# EAGLE design harp behavior encoder v1.0 (EAGLE 6.5.0)
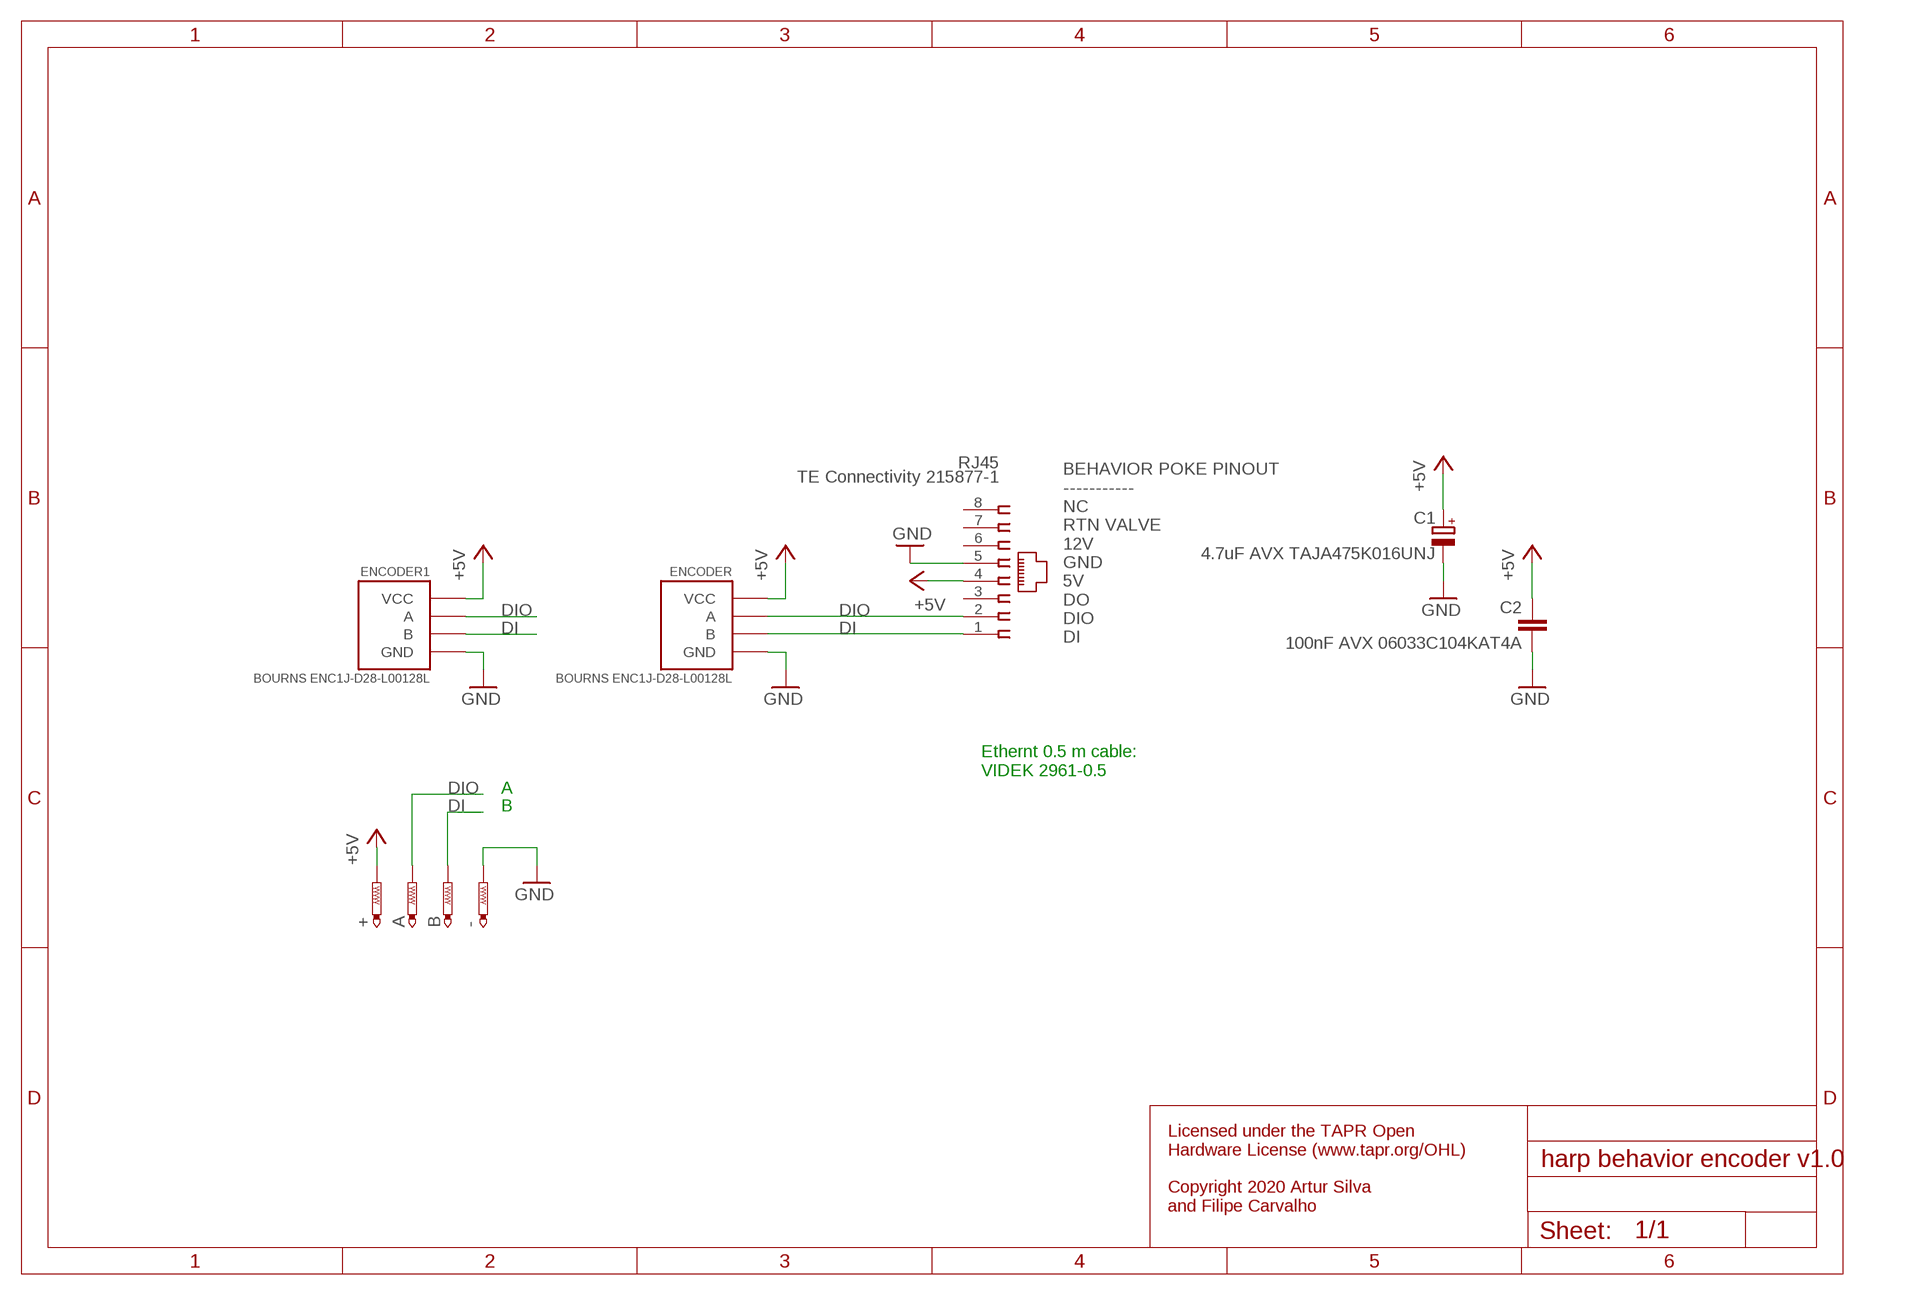
[diagram p0: schematic, sheet 1]

## Parts
+  PTR1PAD1-13  [P1-13]
-  PTR1PAD1-13  [P1-13]
A  PTR1PAD1-13  [P1-13]
B  PTR1PAD1-13  [P1-13]
C1  4.7uF AVX TAJA475K016UNJ  CPOL-EUA/3216-18W  [A/3216-18W]
C2  100nF AVX 06033C104KAT4A  C-EUC0603  [C0603]
ENCODER  BOURNS ENC1J-D28-L00128L  BOURNS_EN  [STYLEC]
ENCODER1  BOURNS ENC1J-D28-L00128L  BOURNS_EN  [STYLEC]
RJ45  TE Connectivity 215877-1  520426-4  [520426-4]

## Nets
+5V: +.TP C1.+ C2.1 ENCODER1.+(VCC) ENCODER.+(VCC) RJ45.4
DI: B.TP ENCODER1.B ENCODER.B RJ45.1
DIO: A.TP ENCODER1.A ENCODER.A RJ45.2
GND: -.TP C1.- C2.2 ENCODER1.-(GND) ENCODER.-(GND) RJ45.5
Unconnected: RJ45.3 RJ45.6 RJ45.7 RJ45.8

## Notes on the sheet
- BEHAVIOR POKE PINOUT
  -----------
  NC
  RTN VALVE
  12V
  GND
  5V
  DO
  DIO
  DI
- Ethernt 0.5 m cable:
  VIDEK 2961-0.5
- A
- B
- Licensed under the TAPR Open 
  Hardware License (www.tapr.org/OHL)
  
  Copyright 2020 Artur Silva 
  and Filipe Carvalho

## Library data of the parts
+ - A B = testpad:PTR1: TEST PIN
C1 = rcl:CPOL-EU: POLARIZED CAPACITOR, European symbol
C2 = rcl:C-EU: CAPACITOR, European symbol
ENCODER ENCODER1 = encoder:BOURNS_EN
RJ45 = con-amp:520426-4: AMP connector

## Board
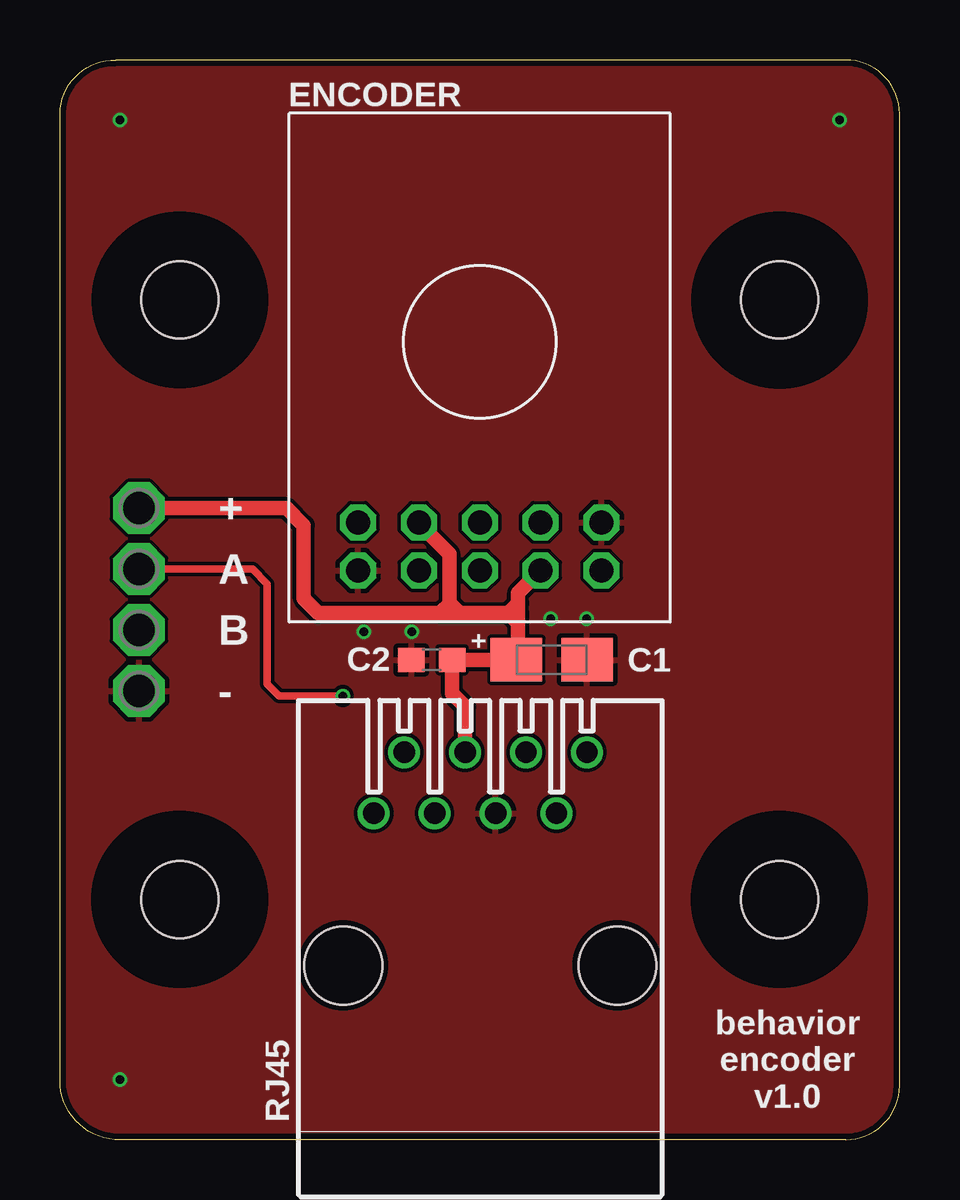
[diagram p1: board, top side]
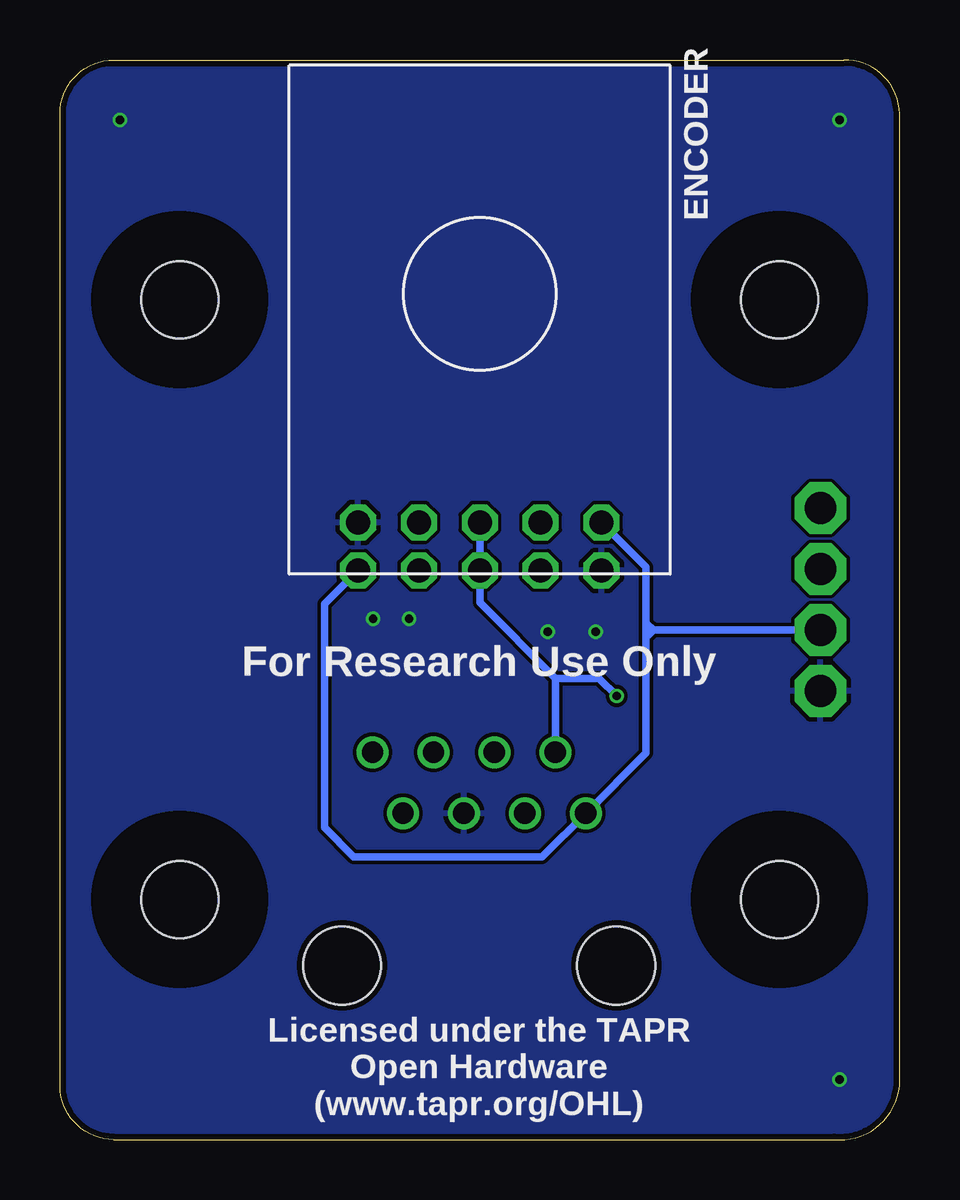
[diagram p2: board, bottom side, seen from below]

Size 35 x 45.01 mm. Coordinates in mm from the lower left corner, seen from the top.
Outline: 32.76,0.01 2.74,0.01 arc-90 0,2.25 0,42.78 arc-90 2.33,45.01 32.76,45.01 arc-90 35,42.78 35,2.25 arc-90 32.76,0.01
Copper layers (1*16): Top 0.018mm / dielectric 1.55mm / Bottom 0.018mm
Design rules "eC_2Layer_PClass6_BaseCopperO18_eCDefault *": minimum track width 0.15mm, minimum drill 0.3mm, track to track 0.15mm, track to pad 0.15mm, pad to pad 0.15mm, via to via 0.15mm, smd to smd 0mil, copper to edge 0.25mm, drill to drill 0.35mm, minimum pad ring 0.175mm, minimum via ring 0.125mm, stop-mask expansion 0mil, vias tented up to drill 0.45mm, thermal gap 0.2mm
Holes 3.2 mm at 5,10.01 30,10.01 5,35.01 30,35.01
tRestrict: area 1.3,31.3 to 8.7,38.7; area 26.3,31.3 to 33.7,38.7; area 1.3,6.3 to 8.7,13.7; area 26.3,6.3 to 33.7,13.7
bRestrict: area 1.3,31.3 to 8.7,38.7; area 26.3,31.3 to 33.7,38.7; area 1.3,6.3 to 8.7,13.7; area 26.3,6.3 to 33.7,13.7

### Footprints (pad centres in the part's own frame; a part is rotated, then mirrored left to right if it is on the bottom)
P1-13 = drill 1.321 pad 2.159 octagon: TP 0,0
A/3216-18W = smd 2.15 x 1.8: + 1.475,0; - -1.475,0
C0603 = smd 1.1 x 1: 1 -0.85,0; 2 0.85,0
STYLEC = drill 1 octagon: + -2.54,9.525; - 5.08,9.525; A 0,9.525; B -5.08,9.525; NC 2.54,9.525
520426-4 = drill 0.889: 1 -4.445,6.35; 2 -3.175,8.89; 3 -1.905,6.35; 4 -0.635,8.89; 5 0.635,6.35; 6 1.905,8.89; 7 3.175,6.35; 8 4.445,8.89 | hole 3.251: -5.715,0; 5.715,0

### Placement (x,y rotation side)
+  3.29,26.33 0 top
-  3.29,18.71 0 top
A  3.29,23.79 0 top
B  3.29,21.25 0 top
C1  20.5,20.01 180 top
C2  15.5,20.01 180 top
ENCODER  17.5,33.26 180 top
ENCODER1  17.5,35.26 180 bottom
RJ45  17.52,7.27 0 top

### Tracks (layer width: path | path; a pad name or v marks a point on that pad's centre or on a via)
+5V
  Top 0.61: RJ45.4 16.89,18.07 16.35,18.61 C2.1 C1.+ 19.1,20.09 19.1,21.55 | ENCODER1.+ 14.96,25.69 16.23,24.42 16.23,22.39 16.26,22.36 | 15.85,21.96 16.66,21.96 | 16.66,21.96 18.69,21.96 | 18.69,21.96 19.1,21.96 | 15.85,21.96 16.26,22.36 | 16.26,22.36 16.66,21.96 | 19.1,21.96 19.1,21.55 | 19.1,21.96 19.1,22.36 | 19.1,22.36 19.1,22.8 ENCODER.+ | 19.1,22.36 18.69,21.96 | 18.69,21.96 19.1,21.55 | 15.85,21.96 10.77,21.96 10.16,22.57 10.16,25.62 9.45,26.33 +.TP
DI
  Bottom 0.305: 10.57,20.94 10.57,16.13 RJ45.1 14.9,11.8 22.76,11.8 23.98,13.02 23.98,22.34 ENCODER.B | 10.57,20.94 10.57,21.2 | 10.57,21.2 10.57,21.55 | 10.57,21.55 10.57,23.88 ENCODER1.B | B.TP 10.51,21.25 10.57,21.2 | 10.57,21.55 10.26,21.25 10.57,20.94
DIO  (via drill 0.35)
  Top 0.305: v11.79,18.5 9.14,18.5 8.64,19.01 8.64,23.18 8.03,23.79 A.TP
  Bottom 0.305: RJ45.2 14.35,19.24 | 14.35,19.24 17.5,22.39 ENCODER.A ENCODER1.A | 14.35,19.24 12.52,19.24 v11.79,18.5
GND  (via drill 0.35)
  other vias: 2.5,2.51 2.5,42.51 32.5,42.51 14.66,21.17 21.95,21.73 12.66,21.17 20.45,21.73
  pour Bottom: 0,45.01 35,45.01 35,0.01 0,0.06
  pour Top: 0,45.01 35,45.01 35,0.01 0,0.01

### Text on the board
tPlace: ENCODER | + | behavior / encoder / v1.0 | Licensed under the TAPR Open / Hardware License (www.tapr.org/OHL) / / Copyright 2020 Artur Silva and Filipe Carvalho
bPlace: ENCODER | For Research Use Only | Licensed under the TAPR / Open Hardware / (www.tapr.org/OHL)